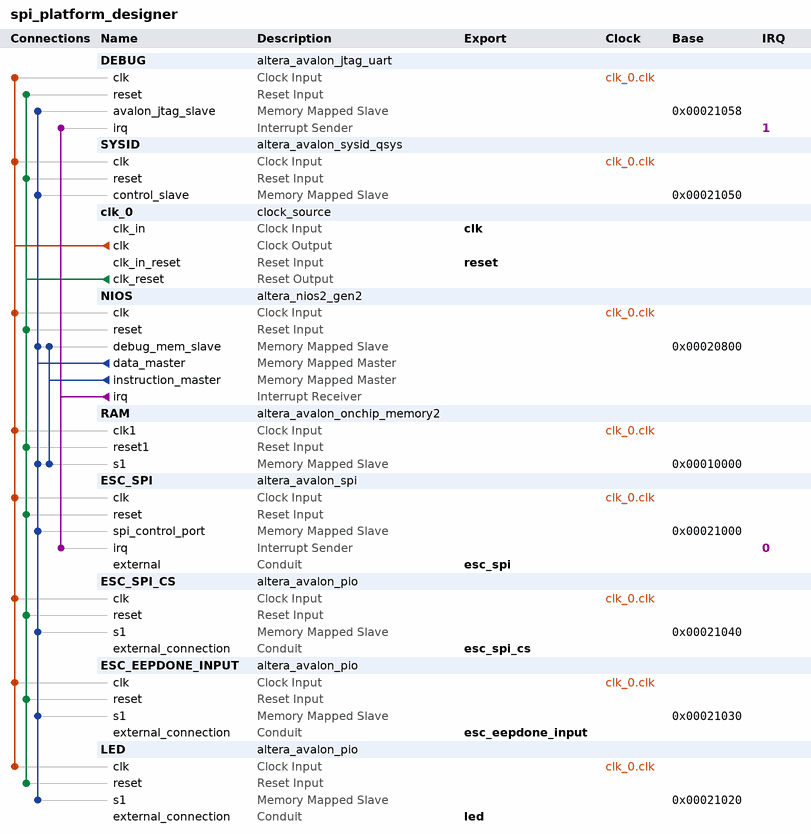
[diagram p0: system contents]
# Platform Designer (Qsys) system spi_platform_designer, Cyclone 10 LP 10CL040YF484C8G
# Parameters at their usual value, and those the tool derives, are not listed.
package require -exact qsys 23.1
create_system spi_platform_designer
set_project_property DEVICE_FAMILY {Cyclone 10 LP}
set_project_property DEVICE 10CL040YF484C8G

add_instance DEBUG altera_avalon_jtag_uart 23.1
set_instance_parameter_value DEBUG simInteractiveOptions NO_INTERACTIVE_WINDOWS

add_instance SYSID altera_avalon_sysid_qsys 23.1
set_instance_parameter_value SYSID id 39011

add_instance clk_0 clock_source 23.1
set_instance_parameter_value clk_0 clockFrequency 50000000

add_instance NIOS altera_nios2_gen2 23.1
set_instance_parameter_value NIOS dcache_size 2048
set_instance_parameter_value NIOS exceptionSlave RAM.s1
set_instance_parameter_value NIOS icache_size 4096
set_instance_parameter_value NIOS impl Tiny
set_instance_parameter_value NIOS resetSlave RAM.s1

add_instance RAM altera_avalon_onchip_memory2 23.1
set_instance_parameter_value RAM dataWidth 32
set_instance_parameter_value RAM dualPort false
set_instance_parameter_value RAM initMemContent true
set_instance_parameter_value RAM initializationFileName onchip_mem.hex
set_instance_parameter_value RAM memorySize 40960

add_instance ESC_SPI altera_avalon_spi 23.1
set_instance_parameter_value ESC_SPI clockPhase 1
set_instance_parameter_value ESC_SPI clockPolarity 1
set_instance_parameter_value ESC_SPI dataWidth 8
set_instance_parameter_value ESC_SPI masterSPI true
set_instance_parameter_value ESC_SPI numberOfSlaves 1
set_instance_parameter_value ESC_SPI targetClockRate 5000000

add_instance ESC_SPI_CS altera_avalon_pio 23.1
set_instance_parameter_value ESC_SPI_CS direction Output
set_instance_parameter_value ESC_SPI_CS resetValue 1
set_instance_parameter_value ESC_SPI_CS width 1

add_instance ESC_EEPDONE_INPUT altera_avalon_pio 23.1
set_instance_parameter_value ESC_EEPDONE_INPUT direction Input
set_instance_parameter_value ESC_EEPDONE_INPUT width 1

add_instance LED altera_avalon_pio 23.1
set_instance_parameter_value LED direction Output
set_instance_parameter_value LED width 1

# connections
add_connection clk_0.clk DEBUG.clk clock
add_connection clk_0.clk ESC_EEPDONE_INPUT.clk clock
add_connection clk_0.clk ESC_SPI.clk clock
add_connection clk_0.clk ESC_SPI_CS.clk clock
add_connection clk_0.clk LED.clk clock
add_connection clk_0.clk NIOS.clk clock
add_connection clk_0.clk RAM.clk1 clock
add_connection clk_0.clk SYSID.clk clock
add_connection clk_0.clk_reset DEBUG.reset reset
add_connection clk_0.clk_reset ESC_EEPDONE_INPUT.reset reset
add_connection clk_0.clk_reset ESC_SPI.reset reset
add_connection clk_0.clk_reset ESC_SPI_CS.reset reset
add_connection clk_0.clk_reset LED.reset reset
add_connection clk_0.clk_reset NIOS.reset reset
add_connection clk_0.clk_reset RAM.reset1 reset
add_connection clk_0.clk_reset SYSID.reset reset
add_connection NIOS.data_master DEBUG.avalon_jtag_slave avalon
set_connection_parameter_value NIOS.data_master/DEBUG.avalon_jtag_slave baseAddress 0x00021058
add_connection NIOS.data_master ESC_EEPDONE_INPUT.s1 avalon
set_connection_parameter_value NIOS.data_master/ESC_EEPDONE_INPUT.s1 baseAddress 0x00021030
add_connection NIOS.data_master ESC_SPI.spi_control_port avalon
set_connection_parameter_value NIOS.data_master/ESC_SPI.spi_control_port baseAddress 0x00021000
add_connection NIOS.data_master ESC_SPI_CS.s1 avalon
set_connection_parameter_value NIOS.data_master/ESC_SPI_CS.s1 baseAddress 0x00021040
add_connection NIOS.data_master LED.s1 avalon
set_connection_parameter_value NIOS.data_master/LED.s1 baseAddress 0x00021020
add_connection NIOS.data_master NIOS.debug_mem_slave avalon
set_connection_parameter_value NIOS.data_master/NIOS.debug_mem_slave baseAddress 0x00020800
add_connection NIOS.data_master RAM.s1 avalon
set_connection_parameter_value NIOS.data_master/RAM.s1 baseAddress 0x00010000
add_connection NIOS.data_master SYSID.control_slave avalon
set_connection_parameter_value NIOS.data_master/SYSID.control_slave baseAddress 0x00021050
add_connection NIOS.instruction_master NIOS.debug_mem_slave avalon
set_connection_parameter_value NIOS.instruction_master/NIOS.debug_mem_slave baseAddress 0x00020800
add_connection NIOS.instruction_master RAM.s1 avalon
set_connection_parameter_value NIOS.instruction_master/RAM.s1 baseAddress 0x00010000
add_connection NIOS.irq DEBUG.irq interrupt
set_connection_parameter_value NIOS.irq/DEBUG.irq irqNumber 1
add_connection NIOS.irq ESC_SPI.irq interrupt
set_connection_parameter_value NIOS.irq/ESC_SPI.irq irqNumber 0

# exported interfaces
add_interface clk clock sink
set_interface_property clk EXPORT_OF clk_0.clk_in
add_interface esc_eepdone_input conduit end
set_interface_property esc_eepdone_input EXPORT_OF ESC_EEPDONE_INPUT.external_connection
add_interface esc_spi conduit end
set_interface_property esc_spi EXPORT_OF ESC_SPI.external
add_interface esc_spi_cs conduit end
set_interface_property esc_spi_cs EXPORT_OF ESC_SPI_CS.external_connection
add_interface led conduit end
set_interface_property led EXPORT_OF LED.external_connection
add_interface reset reset sink
set_interface_property reset EXPORT_OF clk_0.clk_in_reset

set_interconnect_requirement {$system} qsys_mm.clockCrossingAdapter HANDSHAKE
set_interconnect_requirement {$system} qsys_mm.enableEccProtection FALSE
set_interconnect_requirement {$system} qsys_mm.insertDefaultSlave FALSE
set_interconnect_requirement {$system} qsys_mm.maxAdditionalLatency 1

save_system spi_platform_designer.qsys
